# EAGLE design Carte-Principale (EAGLE 9.6.2)
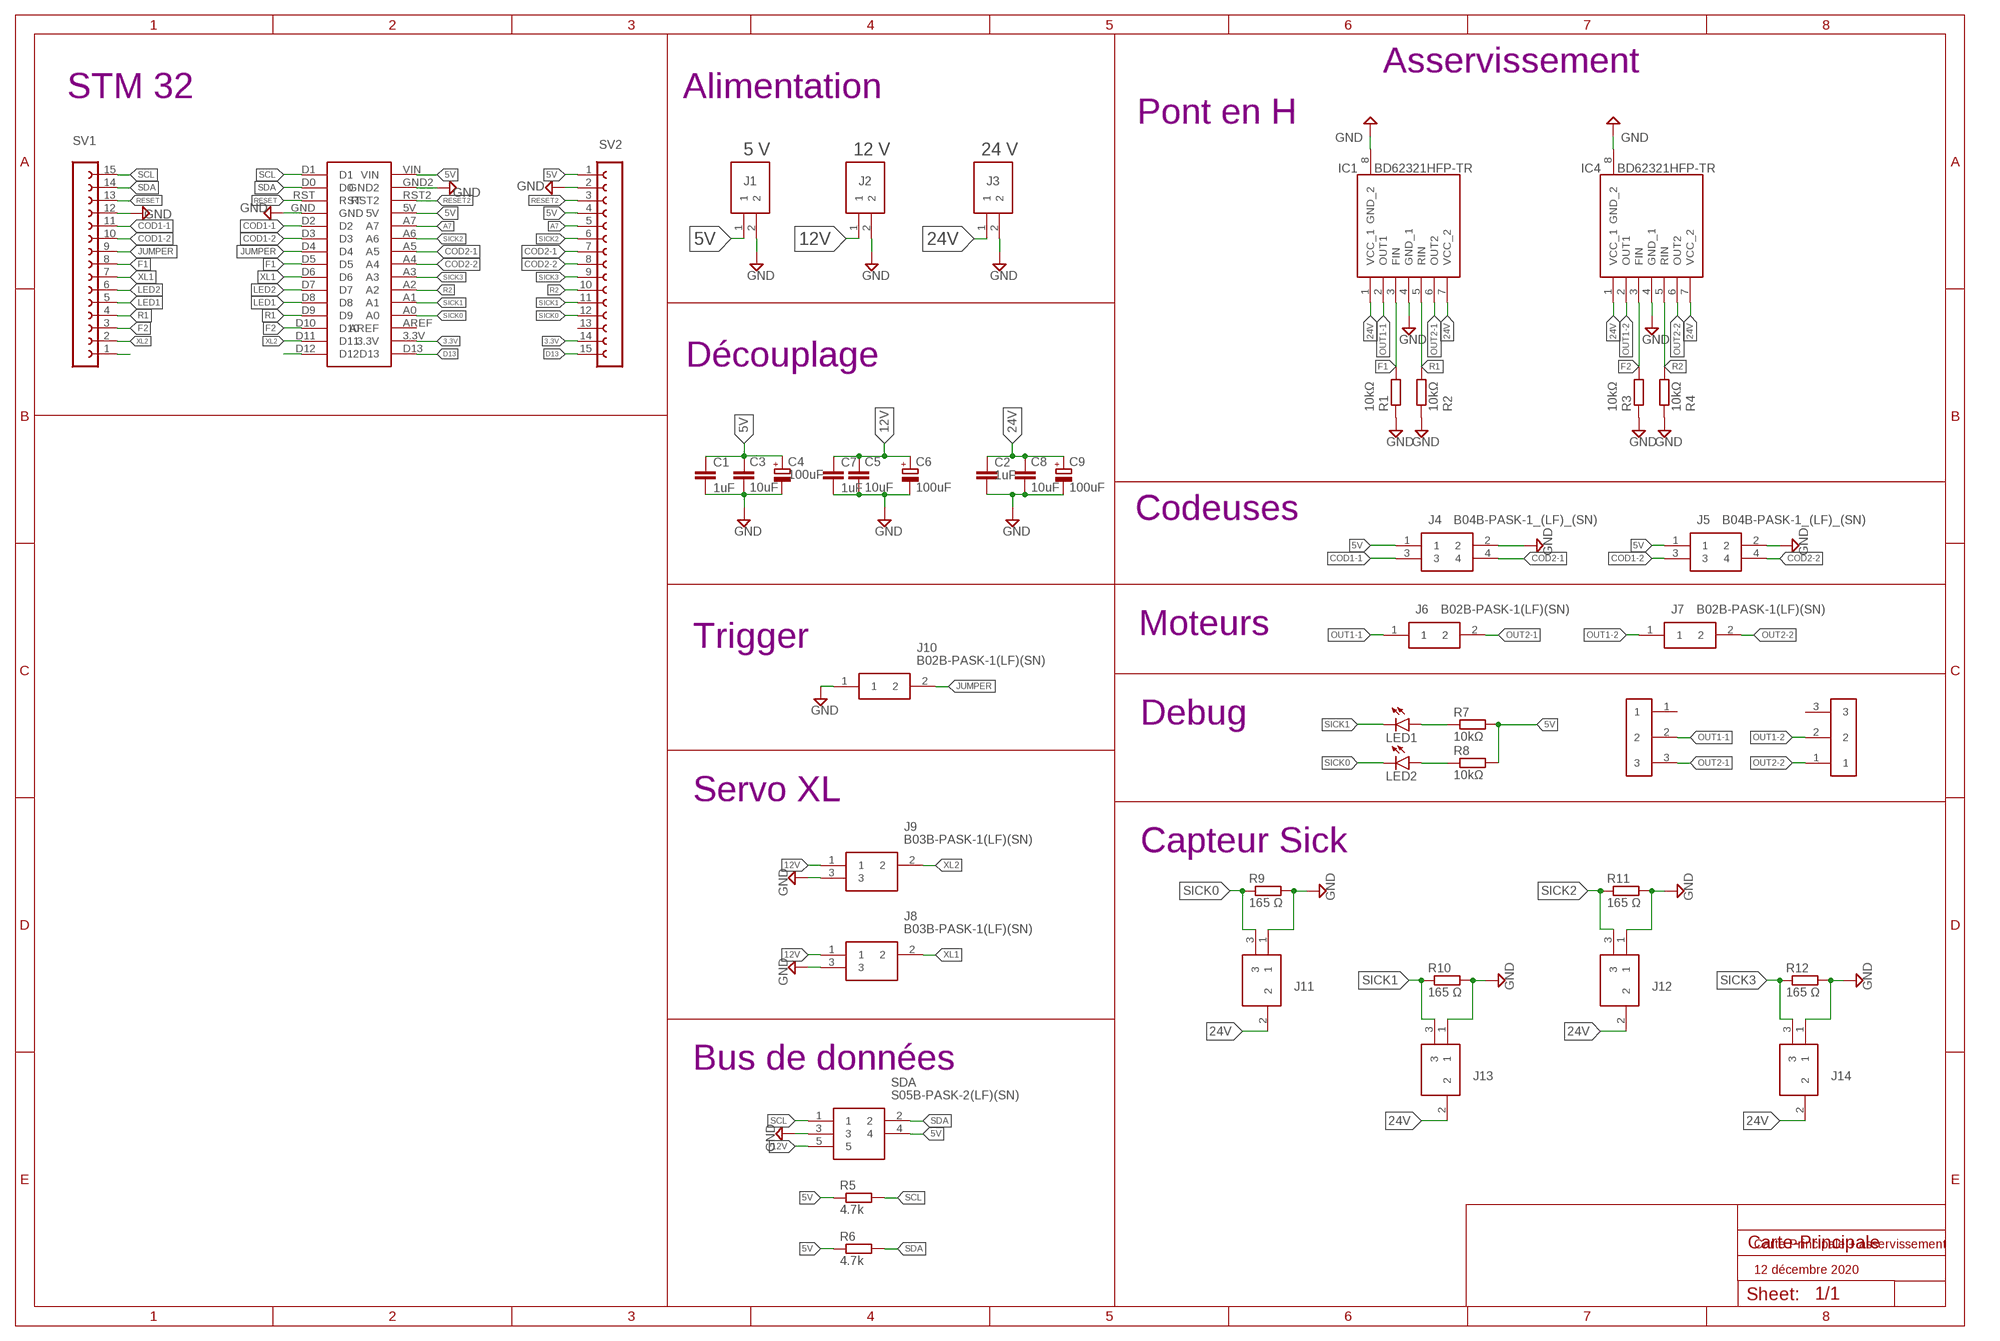
[diagram p0: schematic, sheet 1]

## Parts
C1  1uF  C-EUC0805  [C0805]
C2  1uF  C-EUC0805  [C0805]
C3  10uF  C-EUC0805  [C0805]
C4  100uF  CPOL-EU153CLV-0605  [153CLV-0605]
C5  10uF  C-EUC0805  [C0805]
C6  100uF  CPOL-EU153CLV-0605  [153CLV-0605]
C7  1uF  C-EUC0805  [C0805]
C8  10uF  C-EUC0805  [C0805]
C9  100uF  CPOL-EU153CLV-0605  [153CLV-0605]
IC1  BD62321HFP-TR  [HRP7]
IC4  BD62321HFP-TR  [HRP7]
J1  B2P-VH(LF)(SN)  [SHDR2W114P0X396_1X2_786X850X94]
J2  B2P-VH(LF)(SN)  [SHDR2W114P0X396_1X2_786X850X94]
J3  B2P-VH(LF)(SN)  [SHDR2W114P0X396_1X2_786X850X94]
J4  B04B-PASK-1_(LF)_(SN)  [B04B-PASK-1]
J5  B04B-PASK-1_(LF)_(SN)  [B04B-PASK-1]
J6  B02B-PASK-1(LF)(SN)  [B02BPASK1LFSN]
J7  B02B-PASK-1(LF)(SN)  [B02BPASK1LFSN]
J8  B03B-PASK-1(LF)(SN)  [B03BPASK1LFSN]
J9  B03B-PASK-1(LF)(SN)  [B03BPASK1LFSN]
J10  B02B-PASK-1(LF)(SN)  [B02BPASK1LFSN]
J11  B03B-PASK-1(LF)(SN)  [B03BPASK1LFSN]
J12  B03B-PASK-1(LF)(SN)  [B03BPASK1LFSN]
J13  B03B-PASK-1(LF)(SN)  [B03BPASK1LFSN]
J14  B03B-PASK-1(LF)(SN)  [B03BPASK1LFSN]
LED1  LEDCHIP-LED0805  [CHIP-LED0805]
LED2  LEDCHIP-LED0805  [CHIP-LED0805]
R1  10kΩ  R-EU_R0805  [R0805]
R2  10kΩ  R-EU_R0805  [R0805]
R3  10kΩ  R-EU_R0805  [R0805]
R4  10kΩ  R-EU_R0805  [R0805]
R5  4.7k  R-EU_01005  [R01005]
R6  4.7k  R-EU_01005  [R01005]
R7  10kΩ  R-EU_R0805  [R0805]
R8  10kΩ  R-EU_R0805  [R0805]
R9  165 Ω  R-EU_R0805  [R0805]
R10  165 Ω  R-EU_R0805  [R0805]
R11  165 Ω  R-EU_R0805  [R0805]
R12  165 Ω  R-EU_R0805  [R0805]
SDA  S05B-PASK-2(LF)(SN)  [S05B-PASK-2(LF)(SN)]
SV1  FE15-1  [FE15]
SV2  FE15-1  [FE15]
U$1  STM32-L432KC  [STM32-L432KC]
U$2  HEADER3PIN  [HEADER3PINFOOTPRINT]
U$3  HEADER3PIN  [HEADER3PINFOOTPRINT]

## Nets
3.3V: SV2.14 U$1.3.3V
5V: C1.1 C3.1 C4.+ J1.1 J4.1 J5.1 R5.1 R6.1 R7.2 R8.2 SDA.4 SV2.1 SV2.4 U$1.5V U$1.VIN
12V: C5.1 C6.+ C7.1 J2.1 J8.1 J9.1 SDA.5
24V: C2.1 C8.1 C9.+ IC1.1(VCC_1) IC1.7(VCC_2) IC4.1(VCC_1) IC4.7(VCC_2) J3.1 J11.2 J12.2 J13.2 J14.2
A7: SV2.5 U$1.A7
COD1-1: J4.3 SV1.11 U$1.D2
COD1-2: J5.3 SV1.10 U$1.D3
COD2-1: J4.4 SV2.7 U$1.A5
COD2-2: J5.4 SV2.8 U$1.A4
D13: SV2.15 U$1.D13
F1: IC1.3(FIN) R1.2 SV1.8 U$1.D5
F2: IC4.3(FIN) R3.2 SV1.3 U$1.D10
GND: C1.2 C2.2 C3.2 C4.- C5.2 C6.- C7.2 C8.2 C9.- IC1.4(GND_1) IC1.8(GND_2) IC4.4(GND_1) IC4.8(GND_2) J1.2 J2.2 J3.2 J4.2 J5.2 J8.3 J9.3 J10.1 J11.1 J12.1 J13.1 J14.1 R1.1 R2.1 R3.1 R4.1 R9.2 R10.2 R11.2 R12.2 SDA.3 SV1.12 SV2.2 U$1.GND U$1.GND2
JUMPER: J10.2 SV1.9 U$1.D4
LED1: SV1.5 U$1.D8
LED2: SV1.6 U$1.D7
N$1: LED1.A R7.1
N$2: LED2.A R8.1
N$15: SV1.1
N$70: U$1.D12
OUT1-1: IC1.2(OUT1) J6.1 U$2.2
OUT1-2: IC4.2(OUT1) J7.1 U$3.2
OUT2-1: IC1.6(OUT2) J6.2 U$2.3
OUT2-2: IC4.6(OUT2) J7.2 U$3.1
R1: IC1.5(RIN) R2.2 SV1.4 U$1.D9
R2: IC4.5(RIN) R4.2 SV2.10 U$1.A2
RESET: SV1.13 U$1.RST
RESET2: SV2.3 U$1.RST2
SCL: R5.2 SDA.1 SV1.15 U$1.D1
SDA: R6.2 SDA.2 SV1.14 U$1.D0
SICK0: J11.3 LED2.C R9.1 SV2.12 U$1.A0
SICK1: J13.3 LED1.C R10.1 SV2.11 U$1.A1
SICK2: J12.3 R11.1 SV2.6 U$1.A6
SICK3: J14.3 R12.1 SV2.9 U$1.A3
XL1: J8.2 SV1.7 U$1.D6
XL2: J9.2 SV1.2 U$1.D11
Unconnected: SV2.13 U$1.AREF U$2.1 U$3.3

## Notes on the sheet
- Asservissement
- STM 32 | Alimentation
- Pont en H
- 5 V | 12 V | 24 V
- Découplage
- Codeuses
- Moteurs
- Trigger
- Debug
- Servo XL
- Capteur Sick
- Bus de données
- Carte Principale + asservissement
- 12 décembre 2020

## Library data of the parts
C1-C3 C5 C7 C8 = INTech:C-EU: CAPACITOR, European symbol; SPICEPREFIX: C
C4 C6 C9 = rcl:CPOL-EU: POLARIZED CAPACITOR, European symbol; SPICEPREFIX: C
IC1 IC4 = SamacSys_Parts:BD62321HFP-TR: H-Bridge motor driver,36V,3A,HRP7 ROHM BD62321HFP-TR Full Bridge Motor Driver 3A, 7-Pin HRP7 Source: Datasheet <http://rohmfs.rohm.com/en/products/databook/datasheet/ic/motor/dc/bd62321hfp-e.pdf>; ARROW_PART_NUMBER: BD62321HFP-TR; ARROW_PRICE-STOCK: https://www.arrow.com/en/products/bd62321hfp-tr/rohm-semiconductor; DESCRIPTION: H-Bridge motor driver,36V,3A,HRP7 ROHM BD62321HFP-TR Full Bridge Motor Driver 3A, 7-Pin HRP7; HEIGHT: mm; MANUFACTURER_NAME: ROHM Semiconductor; MANUFACTURER_PART_NUMBER: BD62321HFP-TR; MOUSER_PART_NUMBER: 755-BD62321HFP-TR; MOUSER_PRICE-STOCK: https://www.mouser.co.uk/ProductDetail/ROHM-Semiconductor/BD62321HFP-TR/?qs=IsRgwgmxh6%252BHnTFjkmY4bg%3D%3D
J1-J3 = INTech:B2P-VH(LF)(SN): connector,multipole PCB use,B2P-VH,VH se JST VH Series, 3.96mm Pitch 2 Way 1 Row Straight PCB Header, Solder Termination, 10A Source: Datasheet <http://www.jst-mfg.com/product/pdf/eng/eVH.pdf>; DESCRIPTION: connector,multipole PCB use,B2P-VH,VH se JST VH Series, 3.96mm Pitch 2 Way 1 Row Straight PCB Header, Solder Termination, 10A; HEIGHT: 9.4mm; MANUFACTURER_NAME: JST (JAPAN SOLDERLESS TERMINALS); MANUFACTURER_PART_NUMBER: B2P-VH(LF)(SN); RS_PART_NUMBER: 8201147P; RS_PRICE-STOCK: http://uk.rs-online.com/web/p/products/8201147P
J4 J5 = INTech:B04B-PASK-1_(LF)_(SN): JST Polyamide Series, 2mm Pitch 4 Way 1 Row Straight PCB Header, Solder Termination, 3A Source: Datasheet <http://www.jst-mfg.com/product/pdf/eng/ePA-F.pdf>; DESCRIPTION: JST Polyamide Series, 2mm Pitch 4 Way 1 Row Straight PCB Header, Solder Termination, 3A; HEIGHT: mm; MANUFACTURER_NAME: JST (JAPAN SOLDERLESS TERMINALS); MANUFACTURER_PART_NUMBER: B04B-PASK-1 (LF) (SN); RS_PART_NUMBER: 5128608P; RS_PRICE-STOCK: http://uk.rs-online.com/web/p/products/5128608P
J6 J7 J10 = INTech:B02B-PASK-1(LF)(SN): CONN HEADER VERT 2POS 2MM Source: Datasheet <http://www.jst-mfg.com/product/pdf/eng/ePA-F.pdf>; DESCRIPTION: CONN HEADER VERT 2POS 2MM; HEIGHT: 7.7mm; MANUFACTURER_NAME: JST (JAPAN SOLDERLESS TERMINALS); MANUFACTURER_PART_NUMBER: B02B-PASK-1(LF)(SN)
J8 J9 J11-J14 = INTech:B03B-PASK-1(LF)(SN): CONN HEADER PA 3POS TOP W/BOSS Source: Datasheet <http://www.jst-mfg.com/product/pdf/eng/ePA-F.pdf>; DESCRIPTION: CONN HEADER PA 3POS TOP W/BOSS; HEIGHT: 7mm; MANUFACTURER_NAME: JST (JAPAN SOLDERLESS TERMINALS); MANUFACTURER_PART_NUMBER: B03B-PASK-1(LF)(SN)
LED1 LED2 = INTech:LED: LED OSRAM: - CHIPLED LG R971, LG N971, LY N971, LG Q971, LY Q971, LO R971, LY R971 LH N974, LH R974 LS Q976, LO Q976, LY Q976 LO Q996 - Hyper CHIPLED LW Q18S LB Q993, LB Q99A, LB R99A - SideLED LS A670, LO A670, LY A670, LG A670, LP A670 LB A673, LV A673, LT A673, LW A673 LH A674 LY A675 LS A676, LA A676, LO A676, LY A676, LW A676 LS A679, LY A679, LG A679 - Hyper Micro SIDELED® LS Y876, LA Y876, LO Y876, LY Y876 LT Y87S - SmartLED LW L88C, LW L88S LB L89C, LB L89S, LG L890 LS L89K, LO L89K, LY L89K LS L896, LA L896, LO L896, LY L896 - TOPLED LS T670, LO T670, LY T670, LG T670, LP T670 LSG T670, LSP T670, LSY T670, LOP T670, LYG T670 LG T671, LOG T671, LSG T671 LB T673, LV T673, LT T673, LW T673 LH T674 LS T676, LA T676, LO T676, LY T676, LB T676, LH T676, LSB T676, LW T676 LB T67C, LV T67C, LT T67C, LS T67K, LO T67K, LY T67K, LW E67C LS E67B, LA E67B, LO E67B, LY E67B, LB E67C, LV E67C, LT E67C LW T67C LS T679, LY T679, LG T679 LS T770, LO T770, LY T770, LG T770, LP T770 LB T773, LV T773, LT T773, LW T773 LH T774 LS E675, LA E675, LY E675, LS T675 LS T776, LA T776, LO T776, LY T776, LB T776 LHGB T686 LT T68C, LB T68C - Hyper Mini TOPLED® LB M676 - Mini TOPLED Santana® LG M470 LS M47K, LO M47K, LY M47K Source: http://www.osram.convergy.de LUXEON: - LUMILED® LXK2-PW12-R00, LXK2-PW12-S00, LXK2-PW14-U00, LXK2-PW14-V00 LXK2-PM12-R00, LXK2-PM12-S00, LXK2-PM14-U00 LXK2-PE12-Q00, LXK2-PE12-R00, LXK2-PE12-S00, LXK2-PE14-T00, LXK2-PE14-U00 LXK2-PB12-K00, LXK2-PB12-L00, LXK2-PB12-M00, LXK2-PB14-N00, LXK2-PB14-P00, LXK2-PB14-Q00 LXK2-PR12-L00, LXK2-PR12-M00, LXK2-PR14-Q00, LXK2-PR14-R00 LXK2-PD12-Q00, LXK2-PD12-R00, LXK2-PD12-S00 LXK2-PH12-R00, LXK2-PH12-S00 LXK2-PL12-P00, LXK2-PL12-Q00, LXK2-PL12-R00 Source: www.luxeon.com KINGBRIGHT: KA-3528ASYC Source: www.kingbright.com
R1-R4 R7-R12 = INTech:R-EU_: RESISTOR, European symbol; SPICEPREFIX: R
R5 R6 = rcl:R-EU_: RESISTOR, European symbol; SPICEPREFIX: R
SDA = INTech:S05B-PASK-2(LF)(SN): CONN HEADER PA 5POS SIDE 2MM TIN Source: Datasheet <http://www.jst-mfg.com/product/pdf/eng/ePA-F.pdf>; DESCRIPTION: CONN HEADER PA 5POS SIDE 2MM TIN; HEIGHT: mm; MANUFACTURER_NAME: JST (JAPAN SOLDERLESS TERMINALS); MANUFACTURER_PART_NUMBER: S05B-PASK-2(LF)(SN)
SV1 SV2 = INTech:FE15-1: FEMALE HEADER; OC_FARNELL: unknown; OC_NEWARK: unknown
U$1 = INTech:STM32-L432KC
U$2 U$3 = INTech:HEADER3PIN

## Board
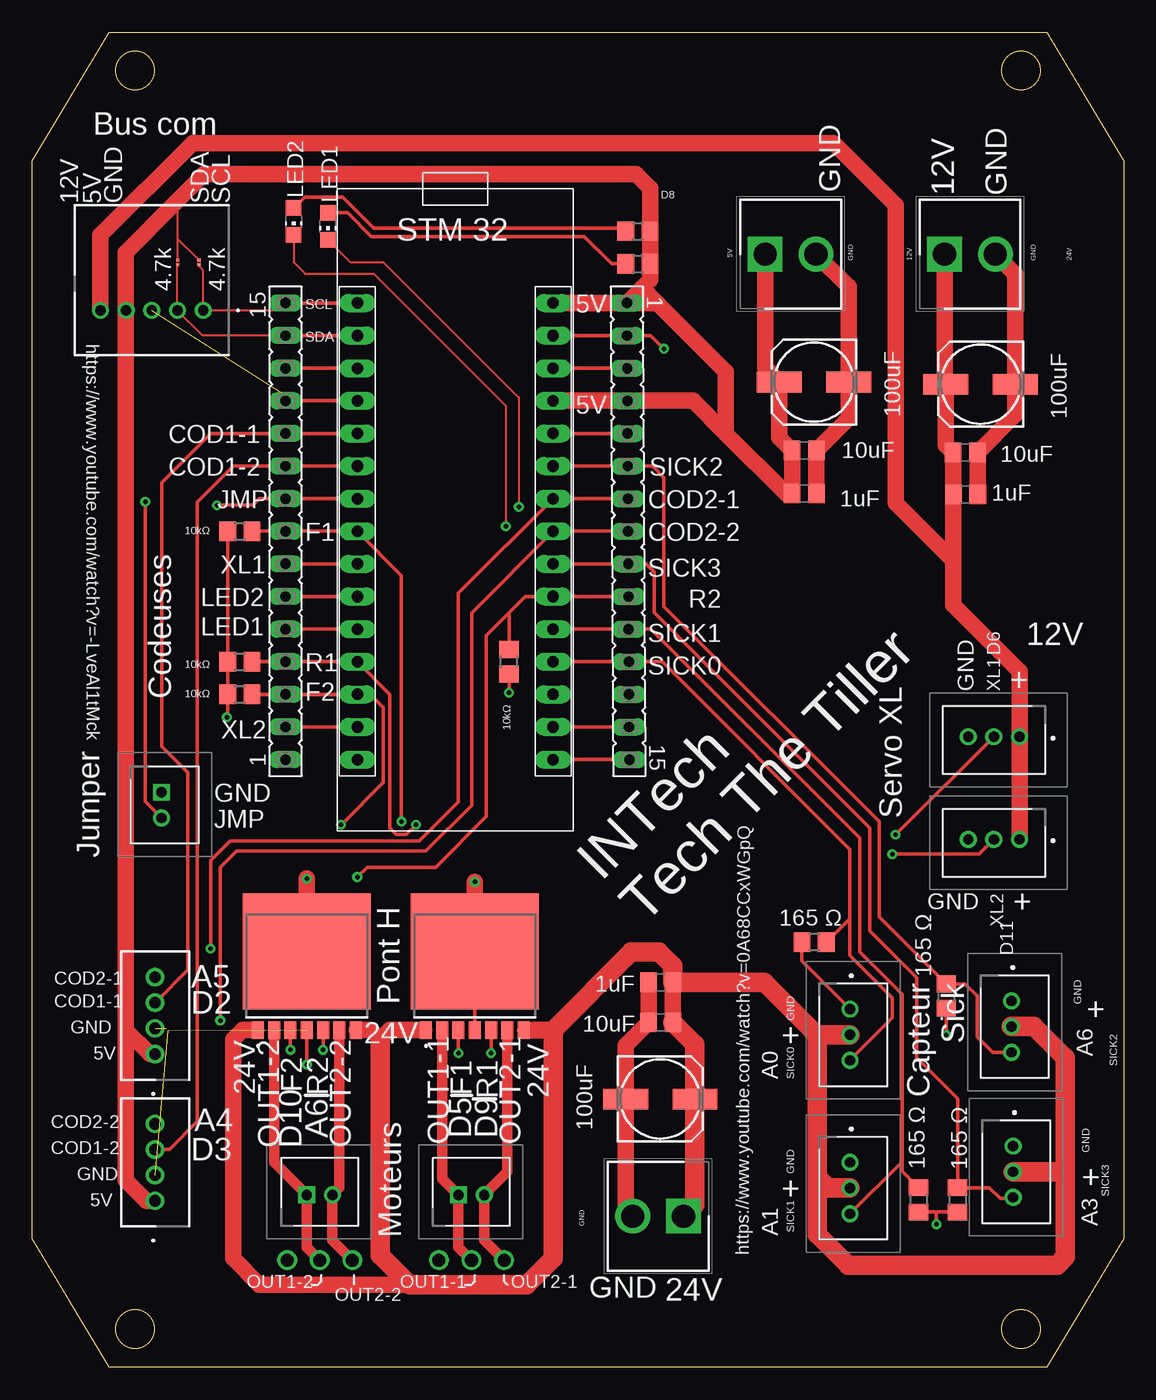
[diagram p1: board, top side]
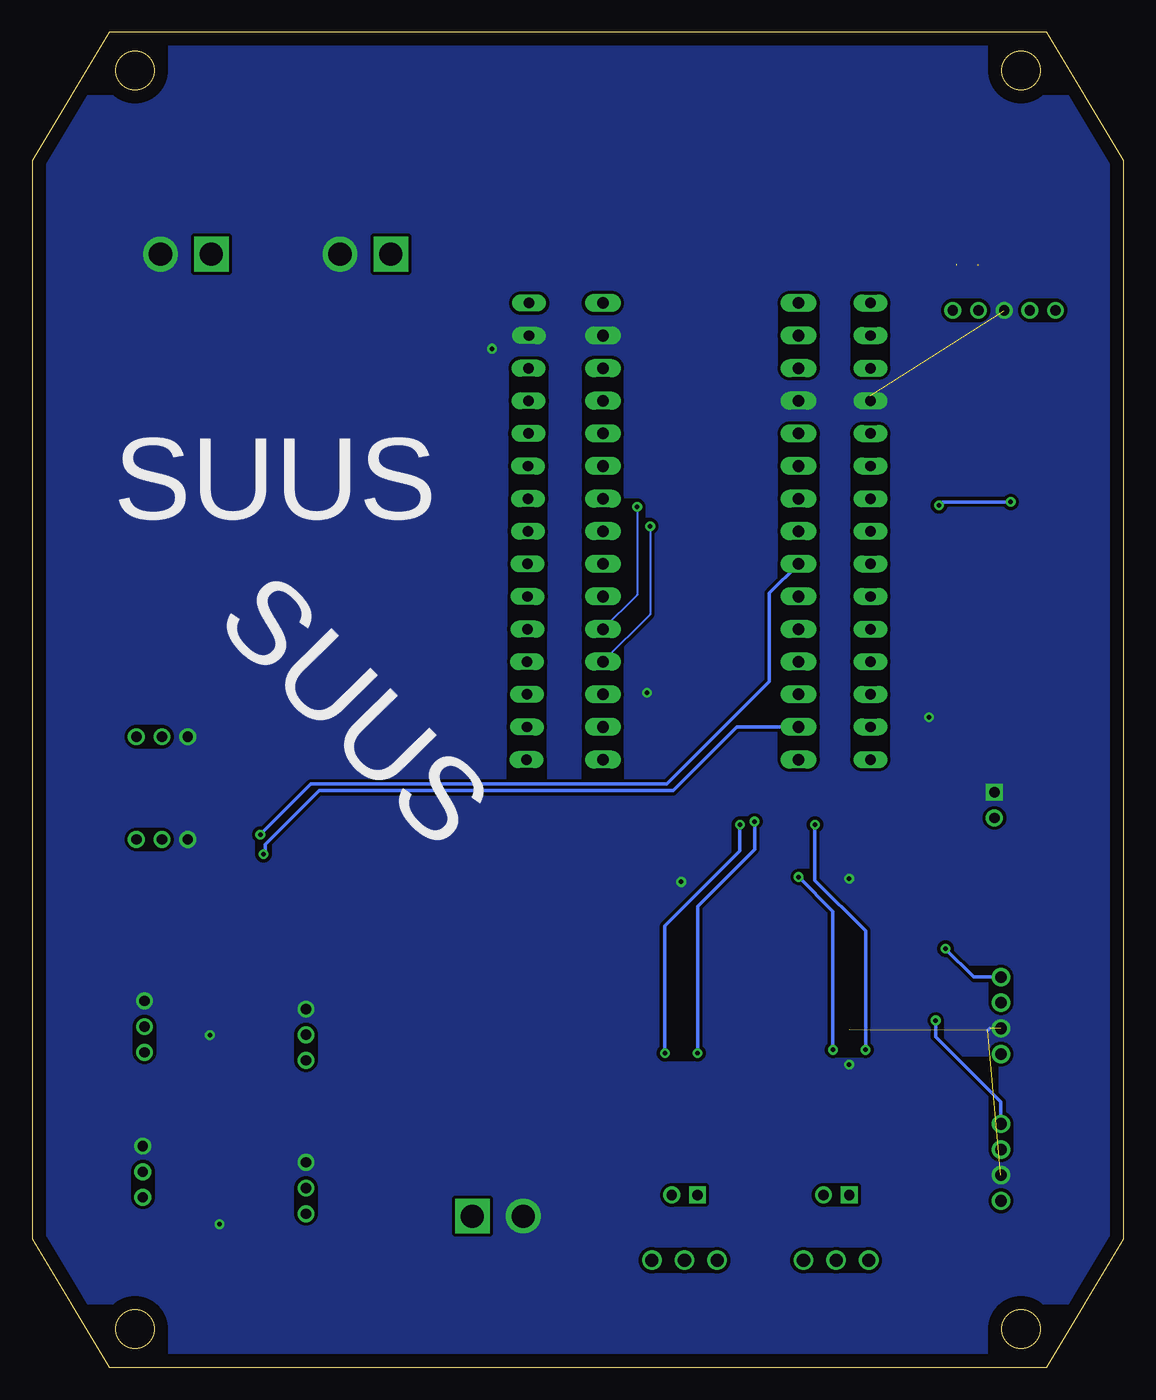
[diagram p2: board, bottom side, seen from below]

Size 85 x 104 mm. Coordinates in mm from the lower left corner, seen from the top.
Outline: 6,104 79,104 85,94 85,10 79,0 6,0 0,10 0,94 6,104
Outline: circle at 8,101 radius 1.5
Outline: circle at 77,101 radius 1.5
Outline: circle at 77,3 radius 1.5
Outline: circle at 8,3 radius 1.5
Copper layers (1*16): Top 0.035mm / dielectric 1.5mm / Bottom 0.035mm
Design rules "default *": minimum track width 6mil, minimum drill 0.35mm, track to track 10mil, track to pad 10mil, pad to pad 10mil, via to via 10mil, smd to smd 10mil, copper to edge 40mil, drill to drill 6mil, minimum pad ring 10mil, minimum via ring 8mil, stop-mask expansion 4mil, vias tented up to drill 0mil, thermal gap 10mil

### Footprints (pad centres in the part's own frame; a part is rotated, then mirrored left to right if it is on the bottom)
C0805 = smd 1.3 x 1.5: 1 -0.95,0; 2 0.95,0
153CLV-0605 = smd 3.5 x 1.6: + 2.7,0; - -2.7,0
HRP7 = smd 0.93 x 1.37: 1 -3.81,-9; 2 -2.54,-9; 3 -1.27,-9; 4 0,-9; 5 1.27,-9; 6 2.54,-9; 7 3.81,-9 | smd 10 x 9: 8 0,-2.875
SHDR2W114P0X396_1X2_786X850X94 = drill 1.8 pad 2.7 square: 1 0,0 | drill 1.8 pad 2.7: 2 3.96,0
B04B-PASK-1 = drill 0.91 pad 1.41: 1 3,0; 2 1,0; 3 -1,0; 4 -3,0
B02BPASK1LFSN = drill 0.8 pad 1.3 square: 1 0,0 | drill 0.8 pad 1.3: 2 -2,0
B03BPASK1LFSN = drill 0.8 pad 1.3: 1 1.65,0.25; 2 -0.35,0.25; 3 -2.35,0.25
CHIP-LED0805 = smd 1.2 x 1.2: A 0,-1.05; C 0,1.05
R0805 = smd 1.3 x 1.5: 1 -0.95,0; 2 0.95,0
R01005 = smd 0.2 x 0.25: 1 -0.163,0; 2 0.163,0
S05B-PASK-2(LF)(SN) = drill 0.8 pad 1.3: 1 4,-2.1; 2 2,-2.1; 3 0,-2.1; 4 -2,-2.1; 5 -4,-2.1
FE15 = drill 0.813 long: 1 -17.78,0; 2 -15.24,0; 3 -12.7,0; 4 -10.16,0; 5 -7.62,0; 6 -5.08,0; 7 -2.54,0; 8 0,0; 9 2.54,0; 10 5.08,0; 11 7.62,0; 12 10.16,0; 13 12.7,0; 14 15.24,0; 15 17.78,0
STM32-L432KC = drill 0.9 pad 1.3 long: 3.3V 7.62,-33.02; 5V 7.62,-7.62; A0 7.62,-27.94; A1 7.62,-25.4; A2 7.62,-22.86; A3 7.62,-20.32; A4 7.62,-17.78; A5 7.62,-15.24; A6 7.62,-12.7; A7 7.62,-10.16; AREF 7.62,-30.48; D0 -7.62,-2.54; D1 -7.62,0; D2 -7.62,-10.16; D3 -7.62,-12.7; D4 -7.62,-15.24; D5 -7.62,-17.78; D6 -7.62,-20.32; D7 -7.62,-22.86; D8 -7.62,-25.4; D9 -7.62,-27.94; D10 -7.62,-30.48; D11 -7.62,-33.02; D12 -7.62,-35.56; D13 7.62,-35.56; GND -7.62,-7.62; GND2 7.62,-2.54; RST -7.62,-5.08; RST2 7.62,-5.08; VIN 7.62,0
HEADER3PINFOOTPRINT = drill 1.02: 1 0,2.54; 2 0,0; 3 0,-2.54

### Placement (x,y rotation side)
C1  60.11,68.05 0 top
C2  48.94,30 180 top
C3  60.12,71.42 0 top
C4  60.88,76.74 180 top
C5  72.66,71.26 0 top
C6  73.85,76.58 180 top
C7  72.68,68 0 top
C8  48.94,26.88 180 top
C9  48.91,20.91 0 top
IC1  34.46,35.27 0 top
IC4  21.38,35.27 0 top
J1  57.07,86.71 0 top
J2  71.04,86.71 0 top
J3  50.72,11.78 180 top
J4  9.57,27.4 270 top
J5  9.57,15.97 270 top
J6  33.19,13.43 180 top
J7  21.38,13.43 180 top
J8  75.23,48.86 0 top
J9  75.23,40.86 0 top
J10  10.08,44.8 90 top
J11  63.93,26.26 90 top
J12  76.5,26.89 90 top
J13  63.93,14.32 90 top
J14  76.63,15.59 90 top
LED1  23.03,88.87 180 top
LED2  20.37,89.25 180 top
R1  16.18,65.12 0 top
R2  16.18,54.96 0 top
R3  16.18,52.42 0 top
R4  37.13,54.96 90 top
R5  13,86.08 270 top
R6  11.35,86.08 270 top
R7  47.16,85.95 0 top
R8  47.16,88.49 0 top
R9  60.88,33.12 180 top
R10  69.01,13.05 270 top
R11  71.17,28.92 270 top
R12  72.06,13.05 270 top
SDA  9.32,84.42 0 top
SV1  19.73,65.12 90 top
SV2  46.4,65.12 270.3 top
U$1  32.94,82.9 0 top
U$2  34.21,8.35 90 top
U$3  22.4,8.35 270 top

### Tracks (layer width: path | path; a pad name or v marks a point on that pad's centre or on a via)
3.3V
  Top 0.254: 46.35,49.88 U$1.3.3V | 46.35,49.88 | 46.35,49.88 SV2.14
5V
  Top 0.152: R6.1 11.35,87.89 | 11.35,87.89 11.35,90.52 11.16,90.71 | R5.1 11.35,87.89
  Top 0.254: SV2.1 46.46,82.9 | U$1.5V 40.69,75.15 | 46.15,75.28 SV2.4
  Top 1.27: J4.1 9.14,24.4 7.29,26.26 | J5.1 8.89,12.97 7.29,14.57 7.29,26.26 | SV2.1 47.5,84.09 | 47.5,84.09 48.11,84.7 R7.2 R8.2 48.11,91.86 47.04,92.93 13.38,92.93 11.16,90.71 7.29,86.84 7.29,82.36 | SV2.1 U$1.VIN | SV2.1 | U$1.5V SV2.4 51.48,75.28 54.02,72.74 | U$1.5V | SV2.1 48.69,82.9 | 54.02,72.74 54.02,77.57 48.69,82.9 | 7.29,82.36 SDA.4 | 7.29,26.26 7.29,82.36 | 48.69,82.9 | 48.69,82.9 47.5,84.09 | J1.1 57.07,77.85 C4.+ 58.18,72.41 C3.1 C1.1 58.71,68.05 54.02,72.74
12V
  Top 1.27: 71.11,86.64 J2.1 71.04,76.69 C6.+ 71.15,71.82 C5.1 71.71,68.01 | J9.1 J8.1 76.88,54.2 71.71,59.37 71.71,62.83 | SDA.5 5.32,88.17 12.49,95.35 62.4,95.35 67.23,90.52 67.23,67.31 71.71,62.83 | 71.71,68.01 C7.1 | 71.71,62.83 71.71,68.01
24V
  Top 0.254: IC4.7 25.28,26.27
  Top 1.016: IC4.1 16.94,26.27 | IC1.1 30.15,26.27 | IC1.7 39.04,26.27
  Top 1.27: 16.94,26.27 16.41,26.27 15.67,25.53 15.67,8.48 17.7,6.45 29.38,6.45 | 30.15,26.27 27.84,26.27 27.1,25.53 26.35,26.27 25.28,26.27 | 39.04,26.27 40.54,26.27 40.56,26.26 38.4,26.26 | C2.1 C8.1
  Top 1.524: 27.1,25.53 27.1,8.73 29.38,6.45 38.53,6.45 40.56,8.48 40.56,26.26 46.66,32.35 48.81,32.35 49.89,31.27 C2.1 57.01,30 61.1,25.91 | 61.1,25.91 J11.2 | 61.1,25.91 61.13,25.88 61.13,14.83 | 61.13,14.83 61.99,13.97 J13.2 | 61.13,14.83 61.13,10.38 63.55,7.97 79.8,7.97 80.44,8.61 80.44,15.24 | 80.44,15.24 J14.2 | J12.2 77.99,26.54 80.44,24.1 80.44,15.24 | C8.1 51.61,25.16 C9.+ 51.61,12.67 J3.1
A7
  Top 0.254: U$1.A7 | SV2.5 U$1.A7
COD1-1
  Top 0.254: U$1.D2 SV1.11 13.89,72.74 10.08,68.93 10.08,48.36 12.11,46.32 12.11,30.94 J4.3
COD1-2
  Top 0.254: U$1.D3 SV1.10 15.67,70.2 12.87,67.41 12.87,19.15 10.7,16.97 J5.3
COD2-1  (via drill 0.35)
  Top 0.254: SV2.7 U$1.A5 33.19,60.29 33.19,44.04 30.15,40.99 15.41,40.99 13.89,39.47 v13.89,32.61
  Bottom 0.254: v13.89,32.61 11.68,30.4 J4.4
COD2-2  (via drill 0.35)
  Top 0.254: SV2.8 U$1.A4 34.21,58.77 34.21,43.78 30.65,40.23 15.92,40.23 14.65,38.96 v14.65,27.02
  Bottom 0.254: v14.65,27.02 14.65,25.75 9.57,20.67 J5.4
D13
  Top 0.254: U$1.D13 46.37,47.34 SV2.15
F1  (via drill 0.35)
  Top 0.254: R1.2 SV1.8 U$1.D5 28.75,61.69 v28.75,42.51 | IC1.3 v33.19,24.48
  Bottom 0.254: v33.19,24.48 33.19,35.91 28.75,40.35 v28.75,42.51
F2  (via drill 0.35)
  Top 0.254: R3.2 SV1.3 U$1.D10 26.34,52.42 27.35,51.4 27.35,45.56 v24.05,42.26 | IC4.3 v20.11,24.73
  Bottom 0.254: v20.11,24.73 20.11,34.01 24.05,37.94 v24.05,42.26
GND  (via drill 0.35)  (4 unrouted)
  Top 0.152: 15.23,52.17 R3.1
  Top 0.254: SV1.12 U$1.GND | U$1.GND2 | U$1.GND2 SV2.2 48.18,80.36 v49.2,79.34 | 34.46,28.67 IC1.4 v34.46,37.81 | 21.64,29.18 21.38,28.92 v21.38,38.07 | R1.1 R2.1 15.23,52.17 | R3.1 15.23,50.71 v15.16,50.64 | J11.1 59.93,31.66 R9.2 | R10.2 70.28,12.1 70.37,12 | 37.13,54.2 R4.1 v37.13,52.55 | 70.37,12 70.41,11.97 v70.41,11.14 | IC4.4 v21.38,23.59 | R12.2 70.47,12.1 70.37,12 | R11.2 v71.17,25.88
  Top 1.27: IC4.8 v21.38,38.07 | IC1.8 v34.46,37.81 | C7.2 73.61,68.01 C5.2 76.55,74.2 C6.- 76.55,85.16 J2.2 | C2.2 C8.2 46.21,25.1 C9.- 46.21,12.33 J3.2 | C1.2 C3.2 63.58,73.93 C4.- 63.58,84.16 J1.2
  Bottom 0.254: 19.73,75.69 SV1.12 | 10.45,26.4 10.59,26.26
  pour Bottom: -15.57,113.89 190.93,113.89 199.31,105.51 199.31,-29.37 191.94,-36.73 -16.84,-36.73 -27.26,-26.32 -27.26,92.55 -28.53,93.82 -28.53,100.93
JUMPER  (via drill 0.35)
  Top 0.254: U$1.D4 SV1.9 17.7,67.66 17.19,67.15 v14.4,67.15 | J10.2 8.81,44.07 v8.81,67.41
  Bottom 0.254: v8.81,67.41 14.14,67.41 v14.4,67.15
LED1
  Top 0.254: SV1.5 U$1.D8
LED2
  Top 0.254: SV1.6 U$1.D7
N$1
  Top 0.254: R7.1 45.13,85.95 43,88.08 26.42,88.08 24.58,89.92 LED1.A
N$2
  Top 0.254: R8.1 45.96,88.74 26.59,88.74 24.18,91.16 21.22,91.16 LED2.A
OUT1-1
  Top 0.813: U$2.2 33.19,9.37 J6.1 31.92,14.7 IC1.2
OUT1-2
  Top 0.813: U$3.2 21.38,9.37 J7.1 18.84,15.97 IC4.2
OUT2-1
  Top 0.813: U$2.3 35.19,9.91 J6.2 37,15.24 IC1.6
OUT2-2
  Top 0.813: IC4.6 23.92,22.96 | 23.92,22.96 23.92,13.97 J7.2 23.38,9.91 U$3.1 | 23.92,22.96
R1  (via drill 0.35)
  Top 0.254: R2.2 SV1.4 U$1.D9 27.86,52.42 27.86,42.01 28.37,41.5 29.13,41.5 v29.89,42.26 | IC1.5 v35.73,24.48
  Bottom 0.254: v35.73,24.48 35.73,34.39 29.89,40.23 v29.89,42.26
R2  (via drill 0.35)
  Top 0.254: IC4.5 v22.65,24.73 | v25.32,38.2 26.08,38.96 31.42,38.96 35.35,42.9 35.35,56.99 37.07,58.71 | 37.07,58.71 38.4,60.04 U$1.A2 SV2.10 | SV2.10 | R4.2 37.13,58.64 37.07,58.71 | SV2.10 46.46,60.04
  Bottom 0.254: v22.65,24.73 22.65,35.53 v25.32,38.2
RESET
  Top 0.254: SV1.13 U$1.RST
RESET2
  Top 0.254: U$1.RST2 SV2.3
SCL  (1 unrouted)
  Top 0.152: 13.32,85.44 SDA.1 19.16,82.32 SV1.15 | 13.32,85.44 13.32,85.49 | 13.32,85.44 13,85.76 13,85.81
  Top 0.254: U$1.D1 SV1.15
SDA  (1 unrouted)
  Top 0.152: SV1.14 13.28,80.36 SDA.2 11.32,85.78 11.35,85.81
  Top 0.254: SV1.14 U$1.D0
SICK0  (via drill 0.35)
  Top 0.152: LED2.C 20.37,86.08 21.26,85.19 26.59,85.19 36.88,74.9 v36.88,65.5
  Top 0.254: U$1.A0 | U$1.A0 SV2.12 49.07,54.96 63.67,40.35 63.67,34.89 | J11.3 66.98,27.21 66.98,28.8 63.67,32.1 63.67,34.89 | R9.1 63.61,34.89 63.67,34.89
  Bottom 0.152: v36.88,65.5 36.88,58.64 U$1.A0
SICK1  (via drill 0.35)
  Top 0.152: LED1.C 24.78,86.08 27.35,86.08 37.89,75.53 v37.89,67.03
  Top 0.254: U$1.A1 | U$1.A1 SV2.11 48.18,57.5 64.44,41.24 64.44,32.35 67.74,29.05 67.74,16.03 | 67.74,16.03 J13.3 | R10.1 67.74,15.27 67.74,16.03
  Bottom 0.152: v37.89,67.03 37.89,60.17 U$1.A1
SICK2
  Top 0.254: J12.3 74.79,24.54 73.58,25.75 73.58,28.92 72.63,29.88 R11.1 65.96,35.08 65.96,42.51 49.2,59.28 49.2,69.31 48.31,70.2 SV2.6 | U$1.A6 SV2.6 | SV2.6
SICK3
  Top 0.254: SV2.9 U$1.A3 | SV2.9 | J14.3 76.31,13.18 75.36,13.18 74.53,14 R12.1 72.06,20.92 68.88,24.1 68.88,30.32 65.2,34.01 65.2,42.02 48.43,58.78 48.43,61.94 47.8,62.58 SV2.9
XL1  (via drill 0.35)
  Top 0.254: SV1.7 U$1.D6 | J8.2 71.08,45.31 71.04,45.31 v67.23,41.5
  Bottom 0.254: U$1.D6 27.61,60.29 27.61,53.44 35.61,45.44 63.29,45.44 v67.23,41.5
XL2  (via drill 0.35)
  Top 0.254: SV1.2 U$1.D11 | J9.2 73.74,39.97 v66.98,39.97
  Bottom 0.254: U$1.D11 30.15,49.88 35.1,44.93 62.66,44.93 66.85,40.74 66.85,40.1 v66.98,39.97

### Text on the board
tNames: Bus com | GND | 12V | 5V | GND | SDA | SCL | D8 | 12V | GND | STM 32 | 5V | GND | 12V | GND | 24V | SCL | 5V | SDA | 5V | COD1-1 | COD1-2 | SICK2 | JMP | COD2-1 | 10kΩ | F1 | COD2-2 | Codeuses | XL1 | SICK3 | LED2 | R2 | LED1 | SICK1 | 12V | D6 | 10kΩ | R1 | SICK0 | GND | XL1 | + | 10kΩ | F2 | XL2 | 10kΩ | https://www.youtube.com/watch?v=-LveAl1tMck | GND | Servo XL | JMP | Jumper | GND | XL2 | + | INTech / Tech The Tiller | D11 | COD2-1 | A5 | Capteur / Sick | COD1-1 | D2 | Pont H | GND | GND | + | GND | 24V | 24V | 24V | + | 5V | A6 | SICK2 | A0 | SICK0 | F2 | R2 | F1 | R1 | COD2-2 | A4 | A6 | D5 | D9 | COD1-2 | OUT1-2 | D10 | OUT2-2 | OUT1-1 | OUT2-1 | GND | D3 | GND | GND | + | 5V | + | SICK3 | GND | SICK1 | A3 | Moteurs | A1 | https://www.youtube.com/watch?v=0A68CCxWGpQ | 24V | OUT1-2 | OUT1-1 | OUT2-1 | OUT2-2 | GND
bNames: SUUS | SUUS